# Altium schematic sheet Breadboard_main.SchDoc: Power Scheme & Control
size A4; SheetNumber: 1; SheetTotal: 1
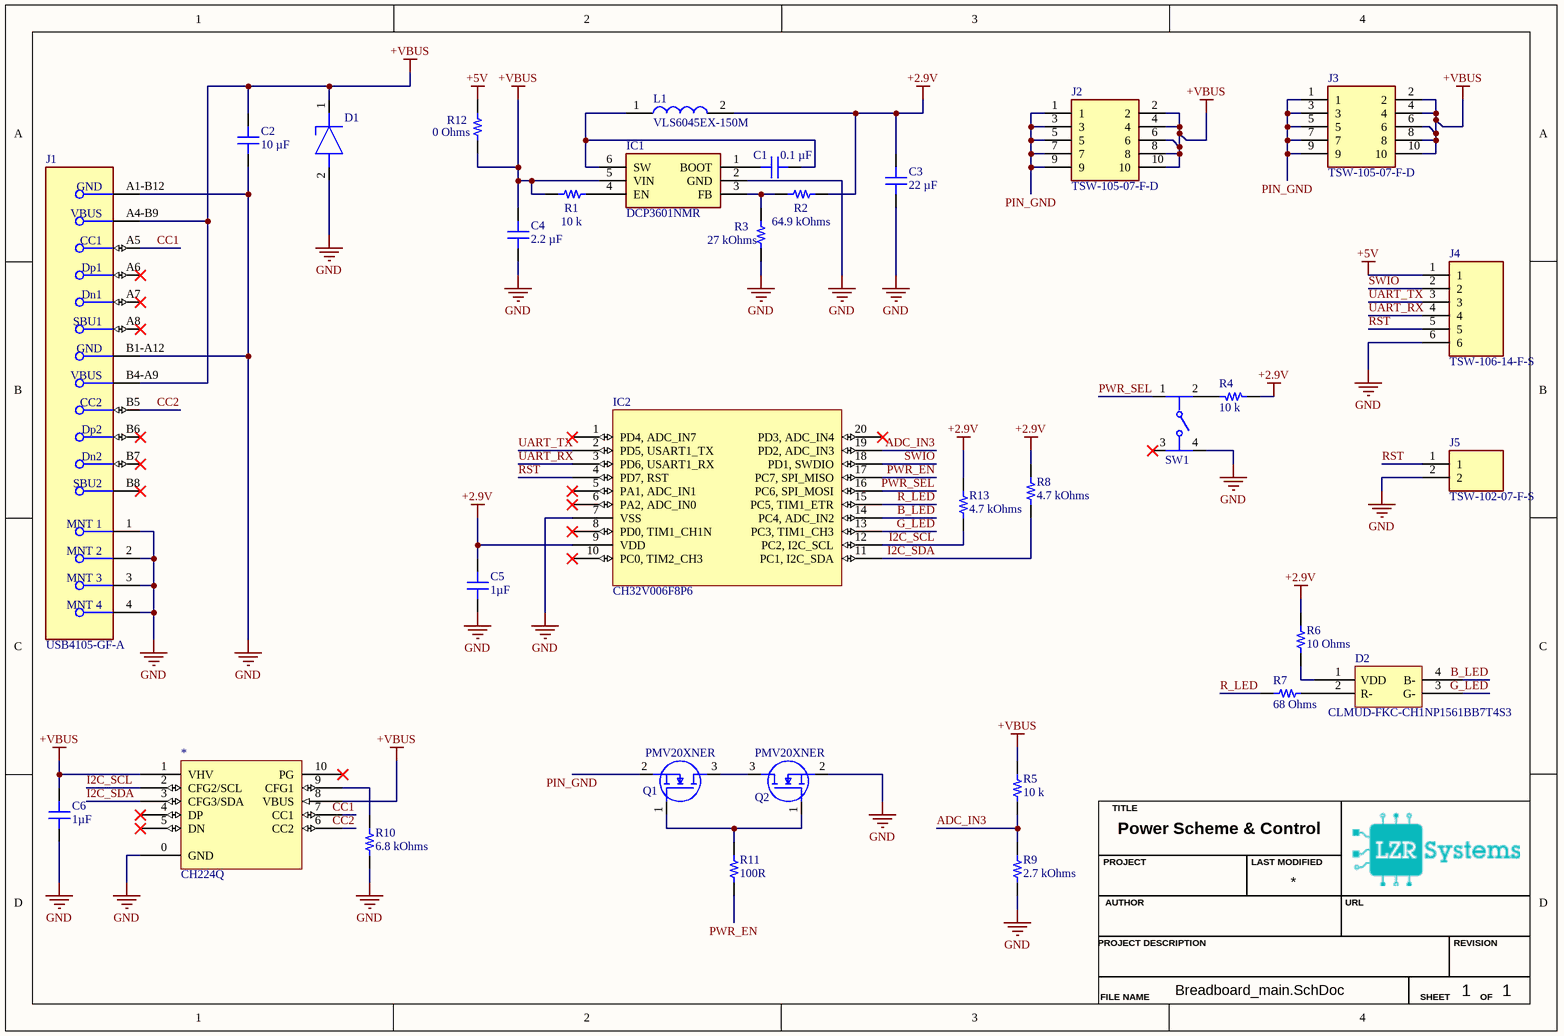
[diagram p0: Breadboard_main.SchDoc]

## Parts
*  CH224Q  [SON40P200X75_HS-11N]
C1  0.1 µF  [CAP 0805_2012]
C2  10 µF  [CAP 1206_3216 - 0.8MM]
C3  22 µF  [CAP 1206_3216 - 0.8MM]
C4  2.2 µF  [CAP 1206_3216 - 0.8MM]
C5  1µF  [CAP 1206_3216 - 1.0MM]
C6  1µF  [CAP 1206_3216 - 1.0MM]
D1  PESD24VS1UA,115  [SOD2512X110N]  (value not drawn)
D2  CLMUD-FKC-CH1NP1561BB7T4S3  [SON70P150X100-4N]
IC1  DCP3601NMR  [SOT95P280X125-6N]
IC2  CH32V006F8P6  [TSOP65P640X110-20N]
J1  USB4105-GF-A  [FP-USB4105-GF-A-MFG]
J2  TSW-105-07-F-D  [TSW-105-XX-YY-D]
J3  TSW-105-07-F-D  [TSW-105-XX-YY-D]
J4  TSW-106-14-F-S  [TSW-106-XX-YY-S]
J5  TSW-102-07-F-S  [TSW-102-XX-YY-S]
L1  VLS6045EX-150M  [VLS6045]
Q1  PMV20XNER  [SOT95P230X110-3N]
Q2  PMV20XNER  [SOT95P230X110-3N]
R1  10 k  [RES 0805_2012]
R2  64.9 kOhms  [RES 0805_2012]
R3  27 kOhms  [YAGEO RES 0805_2012]
R4  10 k  [RES 0805_2012]
R5  10 k  [RES 0805_2012]
R6  10 Ohms  [YAGEO RES 0805_2012]
R7  68 Ohms  [RES 0805_2012]
R8  4.7 kOhms  [RES 0805_2012]
R9  2.7 kOhms  [YAGEO RES 0805_2012]
R10  6.8 kOhms  [RES 0805_2012]
R11  100R  [RES 0805_2012]
R12  0 Ohms  [YAGEO RES 0805_2012]
R13  4.7 kOhms  [RES 0805_2012]
SW1  TL1105AF160Q  [FP-TL1105AF160Q-MFG]  (value not drawn)

## Nets
+2.9V: C3.2 C5.2 IC2.9(VDD) L1.2 R2.2 R4.2 R6.2 R8.2 R13.2
+5V: J4.1 R12.1
+VBUS: *.1(VHV) *.8(VBUS) C2.2 C4.2 C6.2 D1.1(K) IC1.5(VIN) J1.A4-B9(VBUS) J1.B4-A9(VBUS) J2.2 J2.4 J2.6 J2.8 J2.10 J3.2 J3.4 J3.6 J3.8 J3.10 R1.1 R5.1 R12.2
GND: *.0(GND) C2.1 C3.1 C4.1 C5.1 C6.1 D1.2(A) IC1.2(GND) IC2.7(VSS) J1.1(MNT_1) J1.2(MNT_2) J1.3(MNT_3) J1.4(MNT_4) J1.A1-B12(GND) J1.B1-A12(GND) J4.6 J5.2 Q2.2(S) R3.1 R9.2 R10.1 SW1.4
ADC_IN3: IC2.19(PD2,_ADC_IN3) R5.2 R9.1
B_LED: D2.4(B-) IC2.14(PC4,_ADC_IN2)
CC1: *.7(CC1) J1.A5(CC1)
CC2: *.6(CC2) J1.B5(CC2)
G_LED: D2.3(G-) IC2.13(PC3,_TIM1_CH3)
I2C_SCL: *.2(CFG2/SCL) IC2.12(PC2,_I2C_SCL) R13.1
I2C_SDA: *.3(CFG3/SDA) IC2.11(PC1,_I2C_SDA) R8.1
PIN_GND: J2.1 J2.3 J2.5 J2.7 J2.9 J3.1 J3.3 J3.5 J3.7 J3.9 Q1.2(S)
PWR_EN: IC2.17(PC7,_SPI_MISO) R11.1
PWR_SEL: IC2.16(PC6,_SPI_MOSI) SW1.1
R_LED: IC2.15(PC5,_TIM1_ETR) R7.2
RST: IC2.4(PD7,_RST) J4.5 J5.1
SWIO: IC2.18(PD1,_SWDIO) J4.2
UART_RX: IC2.3(PD6,_USART1_RX) J4.4
UART_TX: IC2.2(PD5,_USART1_TX) J4.3
Net*_9: *.9(CFG1) R10.2
NetC1_1: C1.1 IC1.1(BOOT)
NetC1_2: C1.2 IC1.6(SW) L1.1
NetD2_1: D2.1(VDD) R6.1
NetD2_2: D2.2(R-) R7.1
NetIC1_3: IC1.3(FB) R2.1 R3.2
NetIC1_4: IC1.4(EN) R1.2
NetQ1_1: Q1.1(G) Q2.1(G) R11.2
NetQ1_3: Q1.3(D) Q2.3(D)
NetR4_1: R4.1 SW1.2

Not connected (* = marked no-connect by the designer): * 4(DP)* 5(DN)* 10(PG)*; IC2 1(PD4,_ADC_IN7)* 5(PA1,_ADC_IN1)* 6(PA2,_ADC_IN0)* 8(PD0,_TIM1_CH1N)* 10(PC0,_TIM2_CH3)* 20(PD3,_ADC_IN4)*; J1 A6(Dp1)* A7(Dn1)* A8(SBU1)* B6(Dp2)* B7(Dn2)* B8(SBU2)*; SW1 3*

## Notes on the sheet
- TITLE
- AUTHOR
- PROJECT
- LAST MODIFIED
- URL
- PROJECT DESCRIPTION
- REVISION
- FILE NAME
- SHEET
- OF

## Library data of the parts
* = CMP-019-00057-3: USB-PD 3.2 Sink Controller, EPR, PPS, AVS, I2C
C1 = CC0805MRX7R9BB104: CAP CER 0.1UF 50V X7R 0805; manufacturer: Yageo; Tolerance: ±20%; Part Number: CC0805MRX7R9BB104; Capacitance: 0.1 µF; Applications: General Purpose; componentlink1description: Datasheet; componentlink1url: https://www.yageo.com/upload/media/product/productsearch/datasheet/mlcc/UPY-GPHC_X7R_6.3V-to-50V_18.pdf; componentlink2description: DigiKey Link; componentlink2url: https://www.digikey.com/en/products/detail/yageo/CC0805MRX7R9BB104/5884281; Device Package: 0805 (2012 Metric); lastupdated: 2/9/2024 8:16:09 PM; Lifecycle Status: Active; Minimum Order: 1; Mounting Type: Surface Mount, MLCC; Operating Temperature: -55°C ~ 125°C; Package / Case: 0805 (2012 Metric); packaging: TapeAndReel; partid: 2475; Part Status: Active; price: 0.01; series: CC; Size / Dimension: 0.079" L x 0.049" W (2.00mm x 1.25mm); Supplier 1: DigiKey; Supplier Part Number 1: 311-4351-1-ND; Temperature Coefficient: X7R; Thickness (Max): 0.037" (0.95mm); value: 0.1 µF; Voltage - Rated: 50V
C2 = TMK316ABJ106KD-T: CAP CER 10UF 25V X5R 1206; manufacturer: Taiyo Yuden; Tolerance: ±10%; Part Number: TMK316ABJ106KD-T; Capacitance: 10 µF; Applications: SMPS Filtering; componentlink1description: Datasheet; componentlink1url: https://www.yuden.co.jp/productdata/catalog/mlcc01_e.pdf; componentlink2description: DigiKey Link; componentlink2url: https://www.digikey.com/en/products/detail/taiyo-yuden/TMK316ABJ106KD-T/3479441; Device Package: 1206 (3216 Metric); lastupdated: 6/4/2024 7:10:37 PM; Lifecycle Status: Active; Minimum Order: 1; Mounting Type: Surface Mount, MLCC; Operating Temperature: -55°C ~ 85°C; Package / Case: 1206 (3216 Metric); packaging: TapeAndReel; partid: 39924; Part Status: Active; price: 0.06; series: M; Size / Dimension: 0.126" L x 0.063" W (3.20mm x 1.60mm); Supplier 1: DigiKey; Supplier Part Number 1: 587-3236-1-ND; Temperature Coefficient: X5R; Thickness (Max): 0.037" (0.95mm); value: 10 µF; Voltage - Rated: 25V
C3 = CL31A226MOCLNNC: CAP CER 22UF 16V X5R 1206; manufacturer: Samsung Electro-Mechanics; Tolerance: ±20%; Part Number: CL31A226MOCLNNC; Capacitance: 22 µF; Applications: General Purpose; componentlink1description: Datasheet; componentlink1url: http://www.samsungsem.com/kr/support/product-search/mlcc/CL31A226MOCLNNC.jsp; componentlink2description: DigiKey Link; componentlink2url: https://www.digikey.com/en/products/detail/samsung-electro-mechanics/CL31A226MOCLNNC/3888386; Device Package: 1206 (3216 Metric); Features: Low Profile; lastupdated: 6/4/2024 7:10:40 PM; Lifecycle Status: Active; Minimum Order: 1; Mounting Type: Surface Mount, MLCC; Operating Temperature: -55°C ~ 85°C; Package / Case: 1206 (3216 Metric); packaging: TapeAndReel; partid: 19106; Part Status: Active; price: 0.04; series: CL; Size / Dimension: 0.126" L x 0.063" W (3.20mm x 1.60mm); Supplier 1: DigiKey; Supplier Part Number 1: 1276-2728-1-ND; Temperature Coefficient: X5R; Thickness (Max): 0.037" (0.95mm); value: 22 µF; Voltage - Rated: 16V
C4 = GCJ31CR71H225KA12K: CAP CER 2.2UF 50V X7R 1206; manufacturer: Murata Electronics; Tolerance: ±10%; Part Number: GCJ31CR71H225KA12K; Capacitance: 2.2 µF; Applications: Automotive, Boardflex Sensitive; componentlink1description: Datasheet; componentlink1url: https://search.murata.co.jp/Ceramy/image/img/A01X/G101/ENG/GCJ31CR71H225KA12-01.pdf; componentlink2description: DigiKey Link; componentlink2url: https://www.digikey.com/en/products/detail/murata-electronics/GCJ31CR71H225KA12K/11618649; Device Package: 1206 (3216 Metric); Features: Soft Termination; lastupdated: 6/4/2024 7:10:16 PM; Lifecycle Status: Active; Minimum Order: 1; Mounting Type: Surface Mount, MLCC; Operating Temperature: -55°C ~ 125°C; Package / Case: 1206 (3216 Metric); packaging: TapeAndReel; partid: 30270; Part Status: Active; price: 0.06; Ratings: AEC-Q200; series: GCJ; Size / Dimension: 0.126" L x 0.063" W (3.20mm x 1.60mm); Supplier 1: DigiKey; Supplier Part Number 1: 490-GCJ31CR71H225KA12KCT-ND; Temperature Coefficient: X7R; Thickness (Max): 0.075" (1.90mm); value: 2.2 µF; Voltage - Rated: 50V
C5 C6 = 12065C105K4Z2A: CAP CER 1UF 50V X7R 1206; manufacturer: AVX Corporation; Tolerance: ±10%; Part Number: 12065C105K4Z2A; Capacitance: 1µF; Applications: Automotive, Boardflex Sensitive; componentlink1description: Datasheet; componentlink1url: http://datasheets.avx.com/AutoMLCC.pdf; componentlink2description: DigiKey Link; componentlink2url: http://digikey.com/product-detail/en/avx-corporation/12065C105K4Z2A/478-10886-1-ND/7536455; Device Package: 1206 (3216 Metric); Features: Soft Termination; lastupdated: 9/2/2020 1:05:06 AM; Lifecycle Status: Active; Minimum Order: 1; Mounting Type: Surface Mount, MLCC; Operating Temperature: -55°C ~ 125°C; Package / Case: 1206 (3216 Metric); packaging: TapeAndReel; partid: 18944; Part Status: Active; price: 0.12; Ratings: AEC-Q200; series: FLEXITERM®; Size / Dimension: 0.126" L x 0.063" W (3.20mm x 1.60mm); Supplier 1: DigiKey; Supplier Part Number 1: 478-10886-1-ND; Temperature Coefficient: X7R; Thickness (Max): 0.037" (0.94mm); value: 1µF; Voltage - Rated: 50V
D1 = PESD24VS1UA,115: Diode ESD (Uni-directional); Manufacturer_Name: Nexperia; Datasheet Link: https://assets.nexperia.com/documents/data-sheet/PESD24VS1UA.pdf; Height: 1.1mm; Manufacturer_Part_Number: PESD24VS1UA,115; Mouser Part Number: 771-PESD24VS1UA115; Mouser Price/Stock: https://www.mouser.co.uk/ProductDetail/Nexperia/PESD24VS1UA115?qs=A1cBxND5mHKZ%252BhkKKiwSEA%3D%3D; Arrow Part Number: PESD24VS1UA,115; Arrow Price/Stock: https://www.arrow.com/en/products/pesd24vs1ua115/nexperia
D2 = CMP-007-00044-3: Cree LED RGB LED Common Annode If=10mA Vf = 1.9/2.6/2.7
IC1 = DCP3601NMR: Integrated Circuit; Manufacturer_Name: STMicroelectronics; Datasheet Link: https://www.st.com/resource/en/datasheet/dcp3601.pdf; Height: 1.25mm; Manufacturer_Part_Number: DCP3601NMR; Mouser Part Number: 511-DCP3601NMR; Mouser Price/Stock: https://www.mouser.co.uk/ProductDetail/STMicroelectronics/DCP3601NMR?qs=VVKQmw408U%252BduQkqjRfAvg%3D%3D
IC2 = CMP-020-00026-3: CH32V006 is an industrial-grade general-purpose microcontroller based on the QingKe RISC-V core.; Clock Frequency: 48MHz; Interface: I2C, USART, SPI; Min Supply Voltage: 2.7V; Max Supply Voltage: 5V; RAM Size: 8kB; I/Os: 18; Case/Package: TSSOP20; Pins: 20
J1 = CMP-002-00071-1: Conn USB 2.0 Type C RCP 24 POS 0.3mm/0.5mm Solder RA SMD 24 Terminal 1 Port T/R
J2 J3 = TSW-105-07-F-D: Connector; Manufacturer_Name: SAMTEC; Datasheet Link: http://suddendocs.samtec.com/prints/tsw-xxx-xx-xxx-x-xx-xxx-mkt.pdf; Manufacturer_Part_Number: TSW-105-07-F-D; Mouser Part Number: 200-TSW10507FD; Mouser Price/Stock: https://www.mouser.co.uk/ProductDetail/Samtec/TSW-105-07-F-D?qs=rHlcMk0NooLEdgsaetqpvw%3D%3D; Arrow Part Number: TSW-105-07-F-D; Arrow Price/Stock: https://www.arrow.com/en/products/tsw-105-07-f-d/samtec?region=europe
J4 = TSW-106-14-F-S: Connector; Manufacturer_Name: SAMTEC; Datasheet Link: http://suddendocs.samtec.com/prints/tsw-xxx-xx-xxx-x-xx-xxx-mkt.pdf; Manufacturer_Part_Number: TSW-106-14-F-S; Mouser Part Number: 200-TSW10614FS; Mouser Price/Stock: https://www.mouser.co.uk/ProductDetail/Samtec/TSW-106-14-F-S?qs=rU5fayqh%252BE1bS3UjveTNvQ%3D%3D; Arrow Part Number: TSW-106-14-F-S; Arrow Price/Stock: https://www.arrow.com/en/products/tsw-106-14-f-s/samtec
J5 = TSW-102-07-F-S: Connector; Manufacturer_Name: SAMTEC; Datasheet Link: http://suddendocs.samtec.com/prints/tsw-xxx-xx-xxx-x-xx-xxx-mkt.pdf; Manufacturer_Part_Number: TSW-102-07-F-S; Mouser Part Number: 200-TSW10207FS; Mouser Price/Stock: https://www.mouser.co.uk/ProductDetail/Samtec/TSW-102-07-F-S?qs=hzq9O0YpnZuC7JuvEqrjIA%3D%3D; Arrow Part Number: TSW-102-07-F-S; Arrow Price/Stock: https://www.arrow.com/en/products/tsw-102-07-f-s/samtec?utm_currency=USD&region=europe
L1 = VLS6045EX-150M: Inductor; Manufacturer_Name: TDK; Datasheet Link: https://product.tdk.com/system/files/dam/doc/product/inductor/inductor/smd/catalog/inductor_commercial_power_vls6045ex_en.pdf; Manufacturer_Part_Number: VLS6045EX-150M; Mouser Part Number: 810-VLS6045EX-150M; Mouser Price/Stock: https://www.mouser.co.uk/ProductDetail/TDK/VLS6045EX-150M?qs=oF%2FSscNnLpDh4m%2FVdQ%2FgKQ%3D%3D; Arrow Part Number: VLS6045EX-150M; Arrow Price/Stock: https://www.arrow.com/en/products/vls6045ex-150m/tdk?region=nac
Q1 Q2 = PMV20XNER: MOSFET (N-Channel); Manufacturer_Name: Nexperia; Datasheet Link: https://assets.nexperia.com/documents/data-sheet/PMV20XNE.pdf; Height: 1.1mm; Manufacturer_Part_Number: PMV20XNER; Mouser Part Number: 771-PMV20XNER; Mouser Price/Stock: https://www.mouser.co.uk/ProductDetail/Nexperia/PMV20XNER?qs=%252BRKXB2WKlSevPnXiP0DAaQ%3D%3D; Arrow Part Number: PMV20XNER; Arrow Price/Stock: https://www.arrow.com/en/products/pmv20xner/nexperia?utm_currency=USD&region=nac
R1 R4 R5 = RNCS0805BKE10K0: RES 10K OHM 0.1% 1/10W 0805; Manufacturer: Stackpole Electronics Inc; Power (Watts): 0.1W, 1/10W; Resistance: 10 kOhms; Temperature Coefficient: ±25ppm/°C; Part Number: RNCS0805BKE10K0; Value: 10 k; ComponentLink1Description: Datasheet; ComponentLink1URL: https://www.seielect.com/catalog/sei-rncs_rnch.pdf; ComponentLink2Description: DigiKey Link; ComponentLink2URL: https://www.digikey.com/en/products/detail/stackpole-electronics-inc/RNCS0805BKE10K0/1800067; Composition: Thin Film; Device Package: 0805 (2012 Metric); Features: Anti-Corrosive, Automotive AEC-Q200, Moisture Resistant; Height - Seated (Max): 0.026" (0.65mm); LastUpdated: 2/8/2024 9:02:39 PM; Lifecycle Status: Active; Minimum Order: 1; Number of Terminations: 2; Operating Temperature: -55°C ~ 155°C; Package / Case: 0805 (2012 Metric); Packaging: TapeAndReel; PartId: 27713; Part Status: Active; Price: 0.07; Ratings: AEC-Q200; Series: RNCS; Size / Dimension: 0.079" L x 0.049" W (2.00mm x 1.25mm); Supplier 1: DigiKey; Supplier Part Number 1: RNCS0805BKE10K0CT-ND; Supplier Device Package: 0805; Tolerance: ±0.1%
R2 = RMCF0805FT64K9: RES 64.9K OHM 1% 1/8W 0805; Manufacturer: Stackpole Electronics Inc; Power (Watts): 0.125W, 1/8W; Temperature Coefficient: ±100ppm/°C; Part Number: RMCF0805FT64K9; Value: 64.9 kOhms; ComponentLink1Description: Datasheet; ComponentLink1URL: https://www.seielect.com/catalog/sei-packaging.pdf; ComponentLink2Description: DigiKey Link; ComponentLink2URL: https://www.digikey.com/en/products/detail/stackpole-electronics-inc/RMCF0805FT64K9/1713303; Composition: Thick Film; Device Package: 0805 (2012 Metric); Features: Automotive AEC-Q200; Height - Seated (Max): 0.026" (0.65mm); LastUpdated: 2/8/2024 9:01:11 PM; Lifecycle Status: Active; Minimum Order: 1; Number of Terminations: 2; Operating Temperature: -55°C ~ 155°C; Package / Case: 0805 (2012 Metric); Packaging: CutTape; PartId: 47058; Part Status: Active; Price: 0.01; Ratings: AEC-Q200; Resistance: 64.9 kOhms; Series: RMCF; Size / Dimension: 0.079" L x 0.049" W (2.00mm x 1.25mm); Supplier 1: DigiKey; Supplier Part Number 1: 738-RMCF0805FT64K9CT-ND; Supplier Device Package: 0805; Tolerance: ±1%
R3 = AC0805JR-0727KL: RES SMD 27K OHM 5% 1/8W 0805; Manufacturer: Yageo; Power (Watts): 0.125W, 1/8W; Temperature Coefficient: ±100ppm/°C; Part Number: AC0805JR-0727KL; Value: 27 kOhms; ComponentLink1Description: Datasheet; ComponentLink1URL: https://www.yageo.com/upload/media/product/productsearch/datasheet/rchip/PYu-AC_51_RoHS_L_10.pdf; ComponentLink2Description: DigiKey Link; ComponentLink2URL: https://www.digikey.com/en/products/detail/yageo/AC0805JR-0727KL/5897103; Composition: Thick Film; Device Package: 0805 (2012 Metric); Features: Automotive AEC-Q200, Moisture Resistant; Height - Seated (Max): 0.024" (0.60mm); LastUpdated: 7/25/2024 9:20:06 AM; Lifecycle Status: Active; Minimum Order: 1; Number of Terminations: 2; Operating Temperature: -55°C ~ 155°C; Package / Case: 0805 (2012 Metric); Packaging: TapeAndReel; PartId: 84032; Price: 0.01; Ratings: AEC-Q200; Resistance: 27 kOhms; Series: AC; Size / Dimension: 0.079" L x 0.049" W (2.00mm x 1.25mm); Supplier 1: DigiKey; Supplier Part Number 1: 13-AC0805JR-0727KLCT-ND; Supplier Device Package: 0805; Tolerance: ±5%
R6 = RC0805JR-0710RL: RES 10 OHM 5% 1/8W 0805; Manufacturer: Yageo; Power (Watts): 0.125W, 1/8W; Temperature Coefficient: ±200ppm/°C; Part Number: RC0805JR-0710RL; Value: 10 Ohms; ComponentLink1Description: Datasheet; ComponentLink1URL: https://www.yageo.com/upload/media/product/productsearch/datasheet/rchip/PYu-RC_Group_51_RoHS_L_10.pdf; ComponentLink2Description: DigiKey Link; ComponentLink2URL: https://www.digikey.com/en/products/detail/yageo/RC0805JR-0710RL/728240; Composition: Thick Film; Device Package: 0805 (2012 Metric); Features: Moisture Resistant; Height - Seated (Max): 0.024" (0.60mm); LastUpdated: 7/25/2024 9:20:21 AM; Lifecycle Status: Active; Minimum Order: 1; Number of Terminations: 2; Operating Temperature: -55°C ~ 155°C; Package / Case: 0805 (2012 Metric); Packaging: TapeAndReel; PartId: 39854; Part Status: Active; Price: 0.01; Resistance: 10 Ohms; Series: RC_L; Size / Dimension: 0.079" L x 0.049" W (2.00mm x 1.25mm); Supplier 1: DigiKey; Supplier Part Number 1: 311-10ARCT-ND; Supplier Device Package: 0805; Tolerance: ±5%
R7 = CRGP0805F68R: RES 68 OHM 1% 1/3W 0805; Manufacturer: TE Connectivity Passive Product; Power (Watts): 0.333W, 1/3W; Temperature Coefficient: ±100ppm/°C; Part Number: CRGP0805F68R; Value: 68 Ohms; ComponentLink1Description: Datasheet; ComponentLink1URL: https://www.te.com/commerce/DocumentDelivery/DDEController?Action=srchrtrv&DocNm=9-1773463-9&DocType=DS&DocLang=English; ComponentLink2Description: DigiKey Link; ComponentLink2URL: https://www.digikey.com/en/products/detail/te-connectivity-passive-product/CRGP0805F68R/8577065; Composition: Thick Film; Device Package: 0805 (2012 Metric); Features: Pulse Withstanding; Height - Seated (Max): 0.026" (0.65mm); LastUpdated: 2/8/2024 9:02:34 PM; Lifecycle Status: Active; Minimum Order: 1; Number of Terminations: 2; Operating Temperature: -55°C ~ 155°C; Package / Case: 0805 (2012 Metric); Packaging: TapeAndReel; PartId: 28711; Part Status: Active; Price: 0.02; Resistance: 68 Ohms; Series: CRGP; Size / Dimension: 0.079" L x 0.049" W (2.00mm x 1.25mm); Supplier 1: DigiKey; Supplier Part Number 1: A130463CT-ND; Supplier Device Package: 0805; Tolerance: ±1%
R8 R13 = TNPU08054K70AYEA00: RES 4.7 KOHM 0.05% 1/8W 0805; Manufacturer: Vishay Dale; Power (Watts): 0.125W, 1/8W; Temperature Coefficient: ±10ppm/°C; Part Number: TNPU08054K70AYEA00; Value: 4.7 kOhms; ComponentLink1Description: Datasheet; ComponentLink1URL: http://www.vishay.com/docs/28779/tnpue3.pdf; ComponentLink2Description: DigiKey Link; ComponentLink2URL: https://www.digikey.com/en/products/detail/vishay-dale/TNPU08054K70AYEA00/9448863; Composition: Thin Film; Device Package: 0805 (2012 Metric); Features: Anti-Sulfur, Automotive AEC-Q200, Moisture Resistant; Height - Seated (Max): 0.022" (0.55mm); LastUpdated: 2/8/2024 9:02:30 PM; Lifecycle Status: Active; Minimum Order: 1; Number of Terminations: 2; Operating Temperature: -55°C ~ 125°C; Package / Case: 0805 (2012 Metric); Packaging: TapeAndReel; PartId: 29741; Part Status: Active; Price: 0.63; Ratings: AEC-Q200; Resistance: 4.7 kOhms; Series: TNPU e3; Size / Dimension: 0.079" L x 0.049" W (2.00mm x 1.25mm); Supplier 1: DigiKey; Supplier Part Number 1: 541-4670-1-ND; Supplier Device Package: 0805; Tolerance: ±0.05%
R9 = RC0805FR-132K7L: RES 2.7K OHM 1% 1/8W 0805; Manufacturer: Yageo; Power (Watts): 0.125W, 1/8W; Temperature Coefficient: ±100ppm/°C; Part Number: RC0805FR-132K7L; Value: 2.7 kOhms; ComponentLink1Description: Datasheet; ComponentLink1URL: https://www.yageo.com/upload/media/product/productsearch/datasheet/rchip/PYu-RC_Group_51_RoHS_L_11.pdf; ComponentLink2Description: DigiKey Link; ComponentLink2URL: https://www.digikey.com/en/products/detail/yageo/RC0805FR-132K7L/14286471; Composition: Thick Film; Device Package: 0805 (2012 Metric); Height - Seated (Max): 0.024" (0.60mm); LastUpdated: 7/25/2024 9:20:10 AM; Lifecycle Status: Active; Minimum Order: 1; Number of Terminations: 2; Operating Temperature: -55°C ~ 155°C; Package / Case: 0805 (2012 Metric); Packaging: CutTape; PartId: 66308; Part Status: Active; Price: 0.01; Resistance: 2.7 kOhms; Series: RC_L; Size / Dimension: 0.079" L x 0.049" W (2.00mm x 1.25mm); Supplier 1: DigiKey; Supplier Part Number 1: 13-RC0805FR-132K7LCT-ND; Supplier Device Package: 0805; Tolerance: ±1%
R10 = ERJ-6ENF6801V: RES SMD 6.8K OHM 1% 1/8W 0805; Manufacturer: Panasonic Electronic Components; Power (Watts): 0.125W, 1/8W; Temperature Coefficient: ±100ppm/°C; Part Number: ERJ-6ENF6801V; Value: 6.8 kOhms; ComponentLink1Description: Datasheet; ComponentLink1URL: https://industrial.panasonic.com/cdbs/www-data/pdf/RDA0000/AOA0000C304.pdf; ComponentLink2Description: DigiKey Link; ComponentLink2URL: https://www.digikey.com/en/products/detail/panasonic-electronic-components/ERJ-6ENF6801V/1746527; Composition: Thick Film; Device Package: 0805 (2012 Metric); Features: Automotive AEC-Q200; Height - Seated (Max): 0.028" (0.70mm); LastUpdated: 2/8/2024 9:02:28 PM; Lifecycle Status: Active; Minimum Order: 1; Number of Terminations: 2; Operating Temperature: -55°C ~ 155°C; Package / Case: 0805 (2012 Metric); Packaging: TapeAndReel; PartId: 30159; Part Status: Active; Price: 0.01; Ratings: AEC-Q200; Resistance: 6.8 kOhms; Series: ERJ-6EN; Size / Dimension: 0.079" L x 0.049" W (2.00mm x 1.25mm); Supplier 1: DigiKey; Supplier Part Number 1: P6.80KCCT-ND; Supplier Device Package: 0805; Tolerance: ±1%
R11 = CRCW0805180RFKEAHP: RES SMD 180 OHM 1% 1/2W 0805; Manufacturer: Vishay Dale; Power (Watts): 0.5W, 1/2W; Resistance: 180 Ohms; Temperature Coefficient: ±100ppm/°C; Part Number: CRCW0805180RFKEAHP; Value: 100R; ComponentLink1Description: Datasheet; ComponentLink1URL: http://www.vishay.com/docs/20043/crcwhpe3.pdf; ComponentLink2Description: DigiKey Link; ComponentLink2URL: https://www.digikey.com/en/products/detail/vishay-dale/CRCW0805180RFKEAHP/2226882; Composition: Thick Film; Device Package: 0805 (2012 Metric); Features: Automotive AEC-Q200, Pulse Withstanding; Height - Seated (Max): 0.020" (0.50mm); LastUpdated: 2/8/2024 9:02:28 PM; Lifecycle Status: Active; Minimum Order: 1; Number of Terminations: 2; Operating Temperature: -55°C ~ 155°C; Package / Case: 0805 (2012 Metric); Packaging: TapeAndReel; PartId: 30363; Part Status: Active; Price: 0.02; Ratings: AEC-Q200; Series: CRCW-HP; Size / Dimension: 0.079" L x 0.049" W (2.00mm x 1.25mm); Supplier 1: DigiKey; Supplier Part Number 1: 541-180TCT-ND; Supplier Device Package: 0805; Tolerance: ±1%
R12 = RC0805FR-070RL: RES 0 OHM JUMPER 1/8W 0805; Manufacturer: Yageo; Power (Watts): 0.125W, 1/8W; Part Number: RC0805FR-070RL; Value: 0 Ohms; ComponentLink1Description: Datasheet; ComponentLink1URL: https://www.yageo.com/upload/media/product/productsearch/datasheet/rchip/PYu-RC_Group_51_RoHS_L_10.pdf; ComponentLink2Description: DigiKey Link; ComponentLink2URL: https://www.digikey.com/en/products/detail/yageo/RC0805FR-070RL/2827620; Composition: Thick Film; Device Package: 0805 (2012 Metric); Features: Moisture Resistant; Height - Seated (Max): 0.024" (0.60mm); LastUpdated: 7/25/2024 9:20:16 AM; Lifecycle Status: Active; Minimum Order: 1; Number of Terminations: 2; Operating Temperature: -55°C ~ 155°C; Package / Case: 0805 (2012 Metric); Packaging: CutTape; PartId: 47635; Part Status: Active; Price: 0.01; Resistance: 0 Ohms; Series: RC_L; Size / Dimension: 0.079" L x 0.049" W (2.00mm x 1.25mm); Supplier 1: DigiKey; Supplier Part Number 1: 311-0.0CRCT-ND; Supplier Device Package: 0805; Tolerance: Jumper
SW1 = CMP-011-00014-1: Switch Tactile N.O. SPST Round Button PC Pins 0.05A 50VDC 1.57N Thru-Hole; Current Rating: 50mA; Throw Configuration: SPST; Mounting Technology: Through Hole; Min Operating Temperature: -20°C; Max Current Rating: 50mA; Max Operating Temperature: 70°C